# EAGLE design avr-isp-breakout-board (EAGLE 7.7.0)
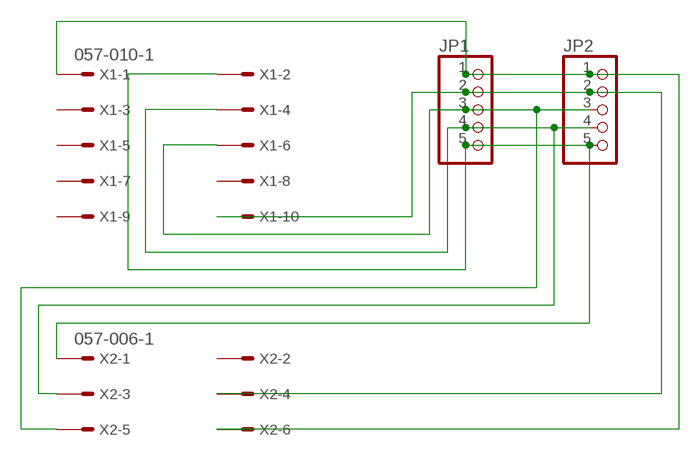
[diagram p0: schematic, sheet 1]

## Parts
JP1  PINHD-1X5  [1X05]
JP2  PINHD-1X5  [1X05]
X1  057-010-1  [057-010-1]
X2  057-006-1  [057-006-1]

## Nets
GND: JP1.1 JP2.1 X1.1 X2.6
MISO: JP1.5 JP2.5 X1.2 X2.1
MOSI: JP1.2 JP2.2 X1.10 X2.4
RESET: JP1.3 JP2.3 X1.6 X2.5
SCK: JP1.4 JP2.4 X1.4 X2.3
Unconnected: X1.3 X1.5 X1.7 X1.8 X1.9 X2.2

## Library data of the parts
JP1 JP2 = pinhead:PINHD-1X5: PIN HEADER
X1 = con-panduit:057-010-: CONNECTOR 10-pin series 057 contact pc board low profile headers; OC_FARNELL: unknown; OC_NEWARK: unknown
X2 = con-panduit:057-006-: CONNECTOR 6-pin series 057 contact pc board low profile headers; OC_FARNELL: unknown; OC_NEWARK: unknown

## Board
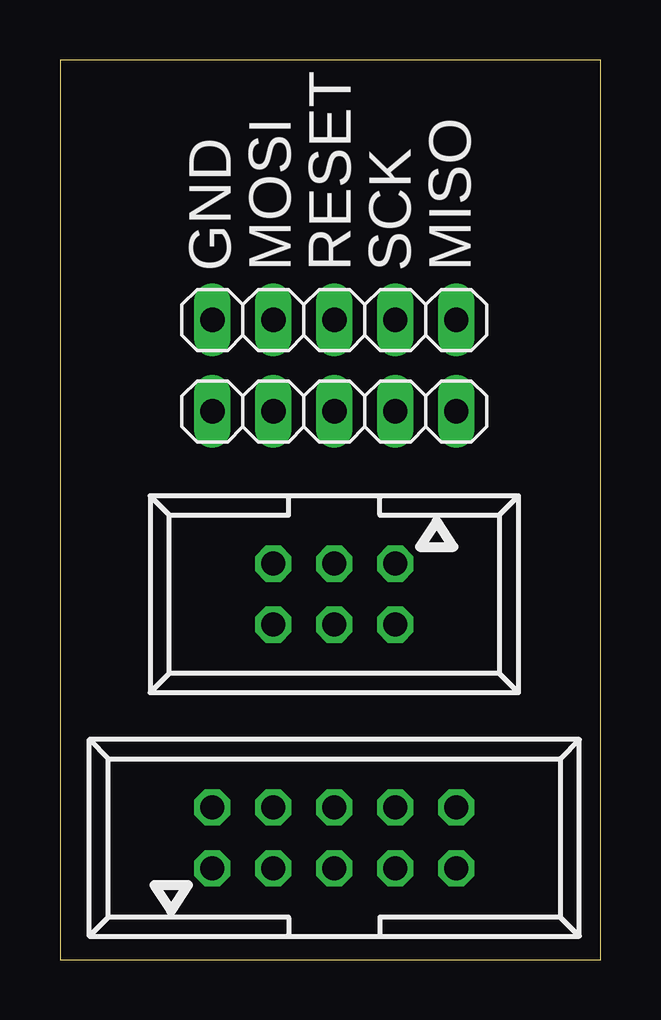
[diagram p1: board, top side]
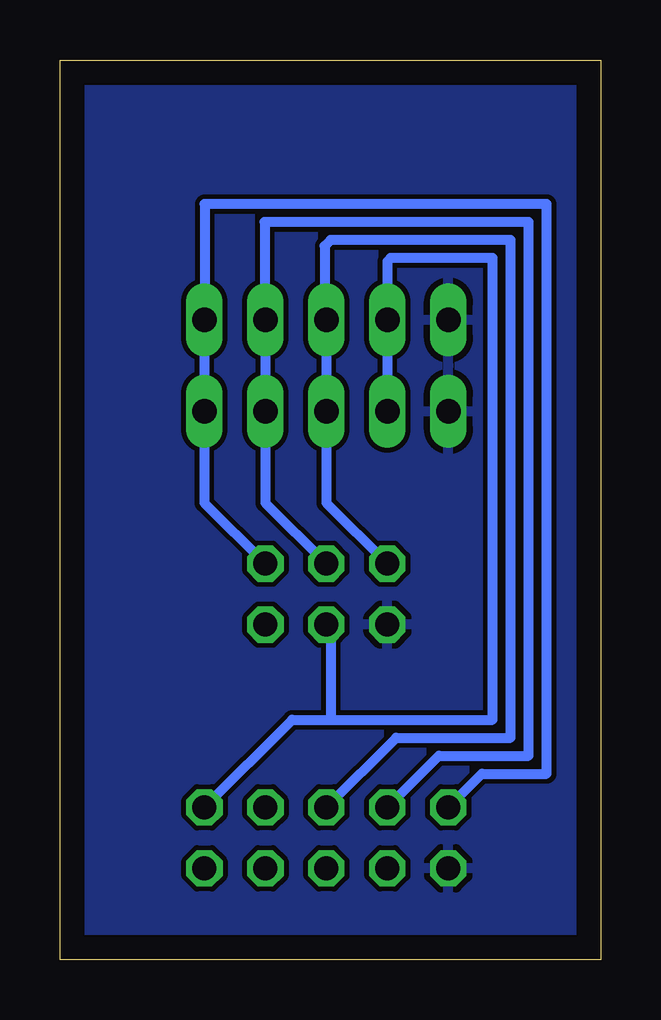
[diagram p2: board, bottom side, seen from below]

Size 22.53 x 37.51 mm. Coordinates in mm from the lower left corner, seen from the top.
Outline: 0,0 22.53,0 22.53,37.51 0,37.51 0,0
Copper layers (1*16): Top 0.035mm / dielectric 1.5mm / Bottom 0.035mm
Design rules "default": minimum track width 10mil, minimum drill 24mil, track to track 8mil, track to pad 8mil, pad to pad 8mil, via to via 8mil, smd to smd 8mil, copper to edge 40mil, drill to drill 8mil, minimum pad ring 10mil, minimum via ring 8mil, stop-mask expansion 4mil, vias tented up to drill 0mil, thermal gap 10mil

### Footprints (pad centres in the part's own frame; a part is rotated, then mirrored left to right if it is on the bottom)
1X05 = drill 1.016 long: 1 -5.08,0; 2 -2.54,0; 3 0,0; 4 2.54,0; 5 5.08,0
057-010-1 = drill 1 octagon: 1 -5.08,-1.27; 2 -5.08,1.27; 3 -2.54,-1.27; 4 -2.54,1.27; 5 0,-1.27; 6 0,1.27; 7 2.54,-1.27; 8 2.54,1.27; 9 5.08,-1.27; 10 5.08,1.27
057-006-1 = drill 1 octagon: 1 -2.54,-1.27; 2 -2.54,1.27; 3 0,-1.27; 4 0,1.27; 5 2.54,-1.27; 6 2.54,1.27

### Placement (x,y rotation side)
JP1  11.43,26.67 0 top
JP2  11.43,22.86 0 top
X1  11.43,5.08 0 top
X2  11.43,15.24 180 top

### Tracks (layer width: path | path; a pad name or v marks a point on that pad's centre or on a via)
GND
  pour Bottom: 0,37.75 22.75,37.75 22.75,0 0,0
MISO
  Bottom 0.406: X2.1 16.51,19.05 JP2.5 JP1.5 16.5,31.5 2.25,31.5 2.25,7.75 4.95,7.75 X1.2
MOSI
  Bottom 0.406: JP2.2 JP1.2 8.89,29.11 8.75,29.25 4.5,29.25 4.5,10 11.25,10 | X1.10 12.86,10 11.25,10 | X2.4 11.25,13.79 11.25,10
RESET
  Bottom 0.406: X2.5 11.43,19.05 JP2.3 JP1.3 11.5,27.24 11.5,29.75 11.25,30 3.75,30 3.75,9.25 8.53,9.25 X1.6
SCK
  Bottom 0.406: X2.3 13.97,19.05 JP2.4 JP1.4 14,27.2 14,30.75 3,30.75 3,8.5 6.74,8.5 X1.4

### Text on the board
tPlace: GND | MOSI | RESET | SCK | MISO